# Altium schematic sheet Вариант9.SchDoc
size A4; SheetNumber: 9; SheetTotal: 10
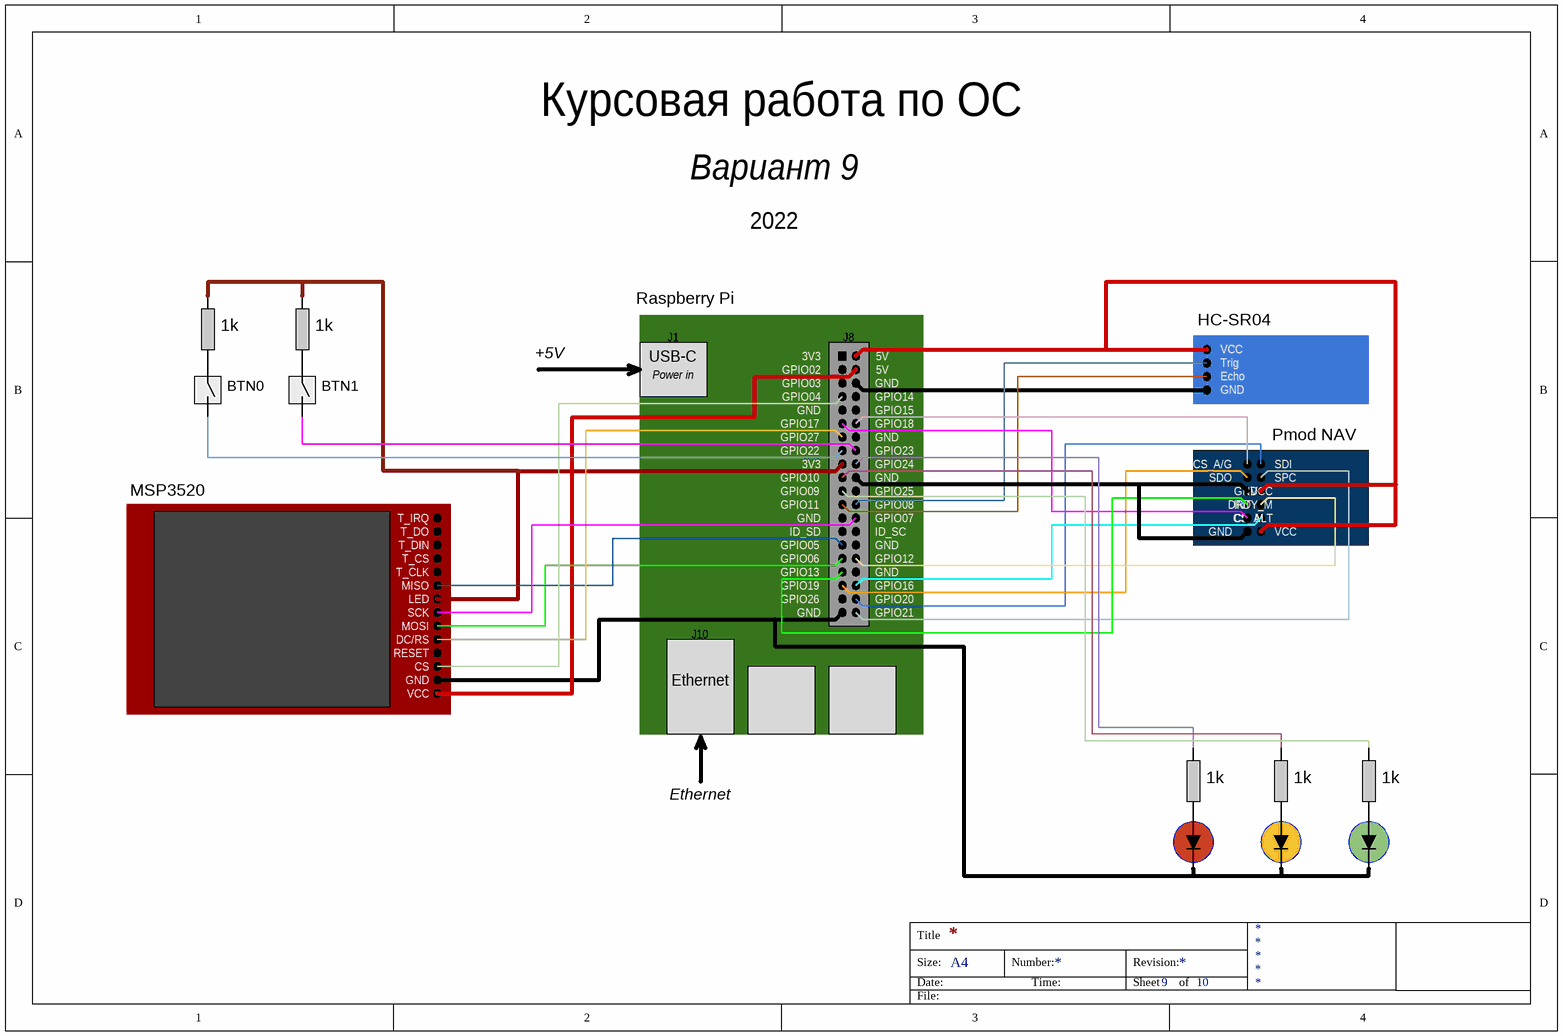
[diagram p0: Вариант9.SchDoc]

## Notes on the sheet
- Курсовая работа по ОС
- Вариант 9
- 2022
- Raspberry Pi
- HC-SR04
- 1k
- BTN0
- BTN1
- +5V
- USB-C
- Power in
- J1
- 3V3
- GPIO02
- GPIO03
- J8
- GND
- 5V
- VCC
- Trig
- Echo
- GPIO17
- GPIO27
- GPIO22
- GPIO04
- GPIO14
- GPIO15
- GPIO18
- GPIO23
- Pmod NAV
- MSP3520
- T_IRQ
- GPIO09
- GPIO10
- GPIO11
- GPIO24
- GPIO25
- GPIO08
- GPIO07
- CS_A/G
- SDO
- INT
- CS_M
- SDI
- SPC
- DRDY_M
- CS_ALT
- T_DO
- T_DIN
- T_CS
- T_CLK
- MISO
- GPIO05
- GPIO06
- GPIO13
- GPIO19
- ID_SD
- ID_SC
- GPIO12
- GPIO16
- RESET
- DC/RS
- MOSI
- SCK
- LED
- J10
- GPIO26
- GPIO20
- GPIO21
- CS
- Ethernet
- Title
- Size:
- Date:
- A4
- Number:
- Time:
- Revision:
- Sheet
- of
- File: